# Altium schematic sheet Safety Devices.SchDoc
size A; SheetNumber: 7; SheetTotal: 9
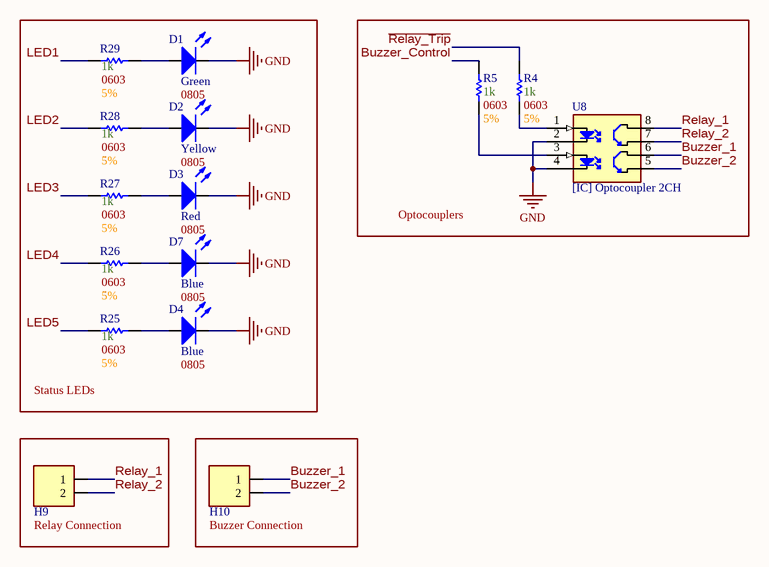
[diagram p0: Safety Devices.SchDoc]

## Parts
D1  Color: Green  Size Package: 0805  [[LED] SMD 0805]  (hidden comment: SMD LED)
D2  Color: Yellow  Size Package: 0805  [[LED] SMD 0805]  (hidden comment: SMD LED)
D3  Color: Red  Size Package: 0805  [[LED] SMD 0805]  (hidden comment: SMD LED)
D4  Color: Blue  Size Package: 0805  [[LED] SMD 0805]  (hidden comment: SMD LED)
D7  Color: Blue  Size Package: 0805  [[LED] SMD 0805]  (hidden comment: SMD LED)
H9  1x2 Male  [[Header] Shrouded 1x2 Male]  (value not drawn)
H10  1x2 Male  [[Header] Shrouded 1x2 Male]  (value not drawn)
R4  Resistance: 1k  Size Package: 0603  Tolerance: 5%  [[Res] SMD 0603]  (hidden comment: [Res] SMD Resistor)
R5  Resistance: 1k  Size Package: 0603  Tolerance: 5%  [[Res] SMD 0603]  (hidden comment: [Res] SMD Resistor)
R25  Resistance: 1k  Size Package: 0603  Tolerance: 5%  [[Res] SMD 0603]  (hidden comment: [Res] SMD Resistor)
R26  Resistance: 1k  Size Package: 0603  Tolerance: 5%  [[Res] SMD 0603]  (hidden comment: [Res] SMD Resistor)
R27  Resistance: 1k  Size Package: 0603  Tolerance: 5%  [[Res] SMD 0603]  (hidden comment: [Res] SMD Resistor)
R28  Resistance: 1k  Size Package: 0603  Tolerance: 5%  [[Res] SMD 0603]  (hidden comment: [Res] SMD Resistor)
R29  Resistance: 1k  Size Package: 0603  Tolerance: 5%  [[Res] SMD 0603]  (hidden comment: [Res] SMD Resistor)
U8  [IC] Optocoupler 2CH  [[IC] Optocoupler 2CH]

## Blocks framed on the sheet
Status LEDs: D1-D4 D7 R25-R29
Optocouplers: R4 R5 U8
Relay Connection: H9
Buzzer Connection: H10

## Nets
GND: D1.2(Cathode) D2.2(Cathode) D3.2(Cathode) D4.2(Cathode) D7.2(Cathode) U8.2(CATHODE_1) U8.4(CATHODE_2)
~{Relay_Trip}: R4.1
Buzzer_1: H10.1 U8.6(Collector)
Buzzer_2: H10.2 U8.5(Emitter)
Buzzer_Control: R5.2
LED1: R29.2
LED2: R28.2
LED3: R27.2
LED4: R26.2
LED5: R25.2
Relay_1: H9.1 U8.8(Collector)
Relay_2: H9.2 U8.7(Emitter)
NetD1_1: D1.1(Anode) R29.1
NetD2_1: D2.1(Anode) R28.1
NetD3_1: D3.1(Anode) R27.1
NetD4_1: D4.1(Anode) R25.1
NetD7_1: D7.1(Anode) R26.1
NetR4_2: R4.2 U8.1(ANODE_1)
NetR5_1: R5.1 U8.3(ANODE_2)

## Library data of the parts
D1-D4 D7 = [LED] SMD: Generic; Part #: *; Supplier 1: DigiKey
  D1: Supplier Part Number 1: 475-LGR971-KN-1CT-ND
  D2: Supplier Part Number 1: 475-LYR976-PS-36-0-20-R18CT-ND
  D3: Supplier Part Number 1: 475-LSR976-NR-1CT-ND
  D4 D7: Supplier Part Number 1: 732-4982-1-ND
H9 H10 = [Header] Shrouded 1x2 Male: 0705430036 / Mates with 0050579402; Supplier 1: DigiKey; Supplier 2: DigiKey; Supplier Part Number 2: WM2900-ND; Supplier Part Number 1: WM4824-ND
R4 R5 R25-R29 = [Res] SMD Resistor: Generic; Supplier 1: DigiKey; Supplier Part Number 1: RMCF0603FT1K00DKR-ND
U8 = [IC] Optocoupler 2CH: Supplier 1: DigiKey; Supplier Part Number 1: 160-2040-1-ND